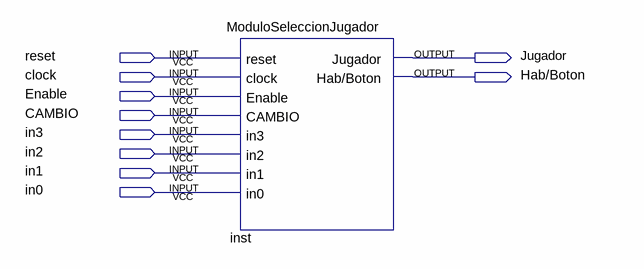
[diagram p0: schematic sheet]
// Quartus schematic Seleccion.bdf as structural Verilog: 1 symbols, 10 pins
module Seleccion (
  input  reset,
  input  clock,
  input  Enable,
  input  CAMBIO,
  input  in3,
  input  in2,
  input  in1,
  input  in0,
  output Jugador,
  output \Hab/Boton 
);

  ModuloSeleccionJugador inst (
    .reset(reset), .clock(clock), .Enable(Enable), .CAMBIO(CAMBIO), .in3(in3), .in2(in2), .in1(in1),
    .in0(in0), .Jugador(Jugador), .\Hab/Boton (\Hab/Boton ));
endmodule
